# Altium schematic sheet Peripherals.SchDoc: Peripherals
size A4; Author: P.A.; CompanyName: STMicroelectronics; Organization: Microcontrollers Division; Address1: 12, Rue Jules HOROWITZ; Address2: 38019 Grenoble; Address3: FRANCE; DocumentNumber: MB1261; Revision: B.01; SheetNumber: 7; SheetTotal: 15; Project: STM32L496G-DISCO
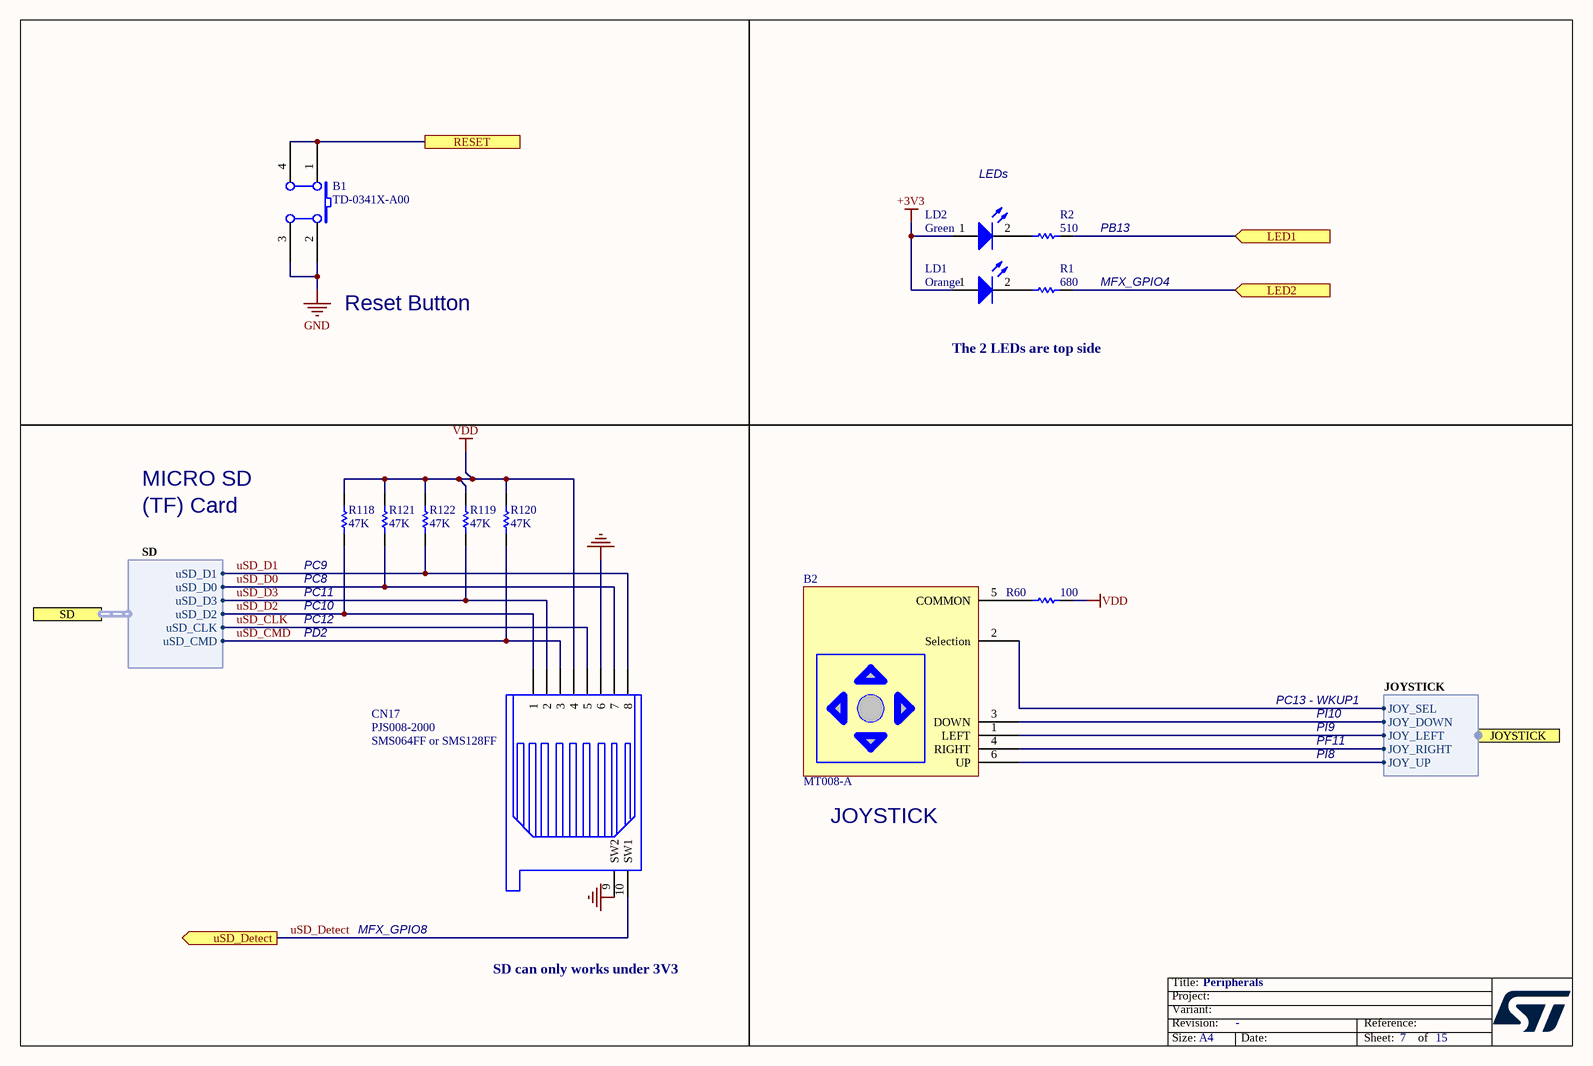
[diagram p0: Peripherals.SchDoc]

## Parts
B1  TD-0341X-A00  [PB10]
B2  MT008-A  [MT-008A]
CN17  PJS008-2000  [MSD_PJS008_]
LD1  Corlor: Orange  [0603D]  (hidden comment: 19-217/S2C-AM2N2VY/3T)
LD2  Corlor: Green  [0603D]  (hidden comment: 19-213SY6C/S530-E2/TR8LED)
R1  value 680  [0603R]  (hidden comment: RC0603FR-07680RL)
R2  value 510  [0603R]  (hidden comment: RC0603FR-07510RL)
R60  value 100  [0603R]  (hidden comment: RC0603JR-07100RL)
R118  47K  [0603R]
R119  47K  [0603R]
R120  47K  [0603R]
R121  47K  [0603R]
R122  47K  [0603R]

## Ports
JOYSTICK (harness JOYSTICK), LED1 (in), LED2 (in), RESET, SD (harness SD), uSD_Detect (out)

## Harnesses
SD: uSD_D0, uSD_CLK, uSD_D1, uSD_D2, uSD_D3, uSD_CMD
JOYSTICK: JOY_SEL, JOY_DOWN, JOY_LEFT, JOY_RIGHT, JOY_UP

## Nets
+3V3: LD1.1(A) LD2.1(A)
GND: B1.2(B0) B1.3(B1) CN17.6 CN17.9(SW2)
VDD: CN17.4 R60.1 R118.2 R119.2 R120.2 R121.2 R122.2
LED1: R2.1 ; port LED1
LED2: R1.1 ; port LED2
RESET: B1.1(A0) B1.4(A1) ; port RESET
uSD_CLK: CN17.5 ; port SD.uSD_CLK
uSD_CMD: CN17.3 R120.1 ; port SD.uSD_CMD
uSD_D0: CN17.7 R121.1 ; port SD.uSD_D0
uSD_D1: CN17.8 R122.1 ; port SD.uSD_D1
uSD_D2: CN17.1 R118.1 ; port SD.uSD_D2
uSD_D3: CN17.2 R119.1 ; port SD.uSD_D3
uSD_Detect: CN17.10(SW1) ; port uSD_Detect
NetB2_1: B2.1(LEFT) ; port JOYSTICK.JOY_LEFT
NetB2_2: B2.2(Selection) ; port JOYSTICK.JOY_SEL
NetB2_3: B2.3(DOWN) ; port JOYSTICK.JOY_DOWN
NetB2_4: B2.4(RIGHT) ; port JOYSTICK.JOY_RIGHT
NetB2_5: B2.5(COMMON) R60.2
NetB2_6: B2.6(UP) ; port JOYSTICK.JOY_UP
NetLD1_2: LD1.2(K) R1.2
NetLD2_2: LD2.2(K) R2.2

## Notes on the sheet
- LEDs
- (near R2) PB13
- Reset Button
- MFX_GPIO4
- The 2 LEDs are top side
- MICRO SD
- (TF) Card
- (near R118) PC8
- (near R118) PC9
- PC11
- PC10
- PC12
- PD2
- PC13 - WKUP1
- PI9
- PI10
- (near CN17) SMS064FF or SMS128FF
- PF11
- PI8
- JOYSTICK
- MFX_GPIO8
- SD can only works under 3V3
- Title:
- Project:
- Size:
- Revision:
- Variant:
- A4
- -
- Date:
- Reference:
- Sheet:
- of

## Library data of the parts
B1 = SW PUSHBUTTON: SE Push Button TD-0341 [RESET/Black]; Manuf_1: Chau-hua; Manuf_Part_1: CTSM-644N-V-T/R; Manuf_2: wealthmetal; Ordered by: Subcon; Assembly: with Back cap; Silkscreen: RESET; ECCN_US/EU: NA; Manuf_Part_2: TD-0341X-A00
B2 = MT-008A: Joystick; Manuf_1: XIEJIA; Ordered by: Subcon; Assembly: with button; ECCN_US/EU: NA; Silkscreen: Joystick; Manuf_Part_1: MT008-A
CN17 = SMS016AFA5E: Manuf_1: Yamaichi; Ordered by: Subcon; Silkscreen: uSD; ECCN_US/EU: NA; Manuf_Part_1: PJS008-2000
LD1 = LED2: LED,Orange,0603; Manuf_1: Everlight; Ordered by: Subcon; ECCN_US/EU: EAR99/NEC; Published: 8-Jun-2000; Revision: July-2002: Re-released for DXP Platform.; Publisher: Altium Limited; Manuf_Part_1: 19-217/S2C-AM2N2VY/3T
LD2 = LED2: LED,Green,0603; Manuf_1: Everlight; Ordered by: Subcon; ECCN_US/EU: EAR99/NEC; Published: 8-Jun-2000; Revision: July-2002: Re-released for DXP Platform.; Publisher: Altium Limited; Manuf_Part_1: 19-213SY6C/S530-E2/TR8LED
R1 = res1: Resistor,680R,0603,1%,YAGEO; Ordered by: Subcon; ECCN_US/EU: NA; Published: 8-Jun-2000; Revision: July-2002: Re-released for DXP Platform.; Publisher: Altium Limited; Manuf_1: YAGEO; Manuf_Part_1: RC0603FR-07680RL
R2 = res1: Resistor,510R,0603,1%,YAGEO; Ordered by: Subcon; ECCN_US/EU: NA; Published: 8-Jun-2000; Revision: July-2002: Re-released for DXP Platform.; Publisher: Altium Limited; Manuf_1: YAGEO; Manuf_Part_1: RC0603FR-07510RL
R60 = res1: Resistor, 100 ,0603,1%,YAGEO; Ordered by: Subcon; ECCN_US/EU: NA; Published: 8-Jun-2000; Revision: July-2002: Re-released for DXP Platform.; Publisher: Altium Limited; Manuf_1: YAGEO; Manuf_Part_1: RC0603JR-07100RL
R118-R122 = res1: Resistor,47K,0603,1%,YAGEO; Manuf_Part_1: RC0603FR-0747KL; Ordered by: Subcon; ECCN_US/EU: NA; Published: 8-Jun-2000; Revision: July-2002: Re-released for DXP Platform.; Publisher: Altium Limited; Value: 47K; Manuf_1: YAGEO